# Altium schematic sheet 6-PadsControl+CodSwitch.SchDoc
size A4
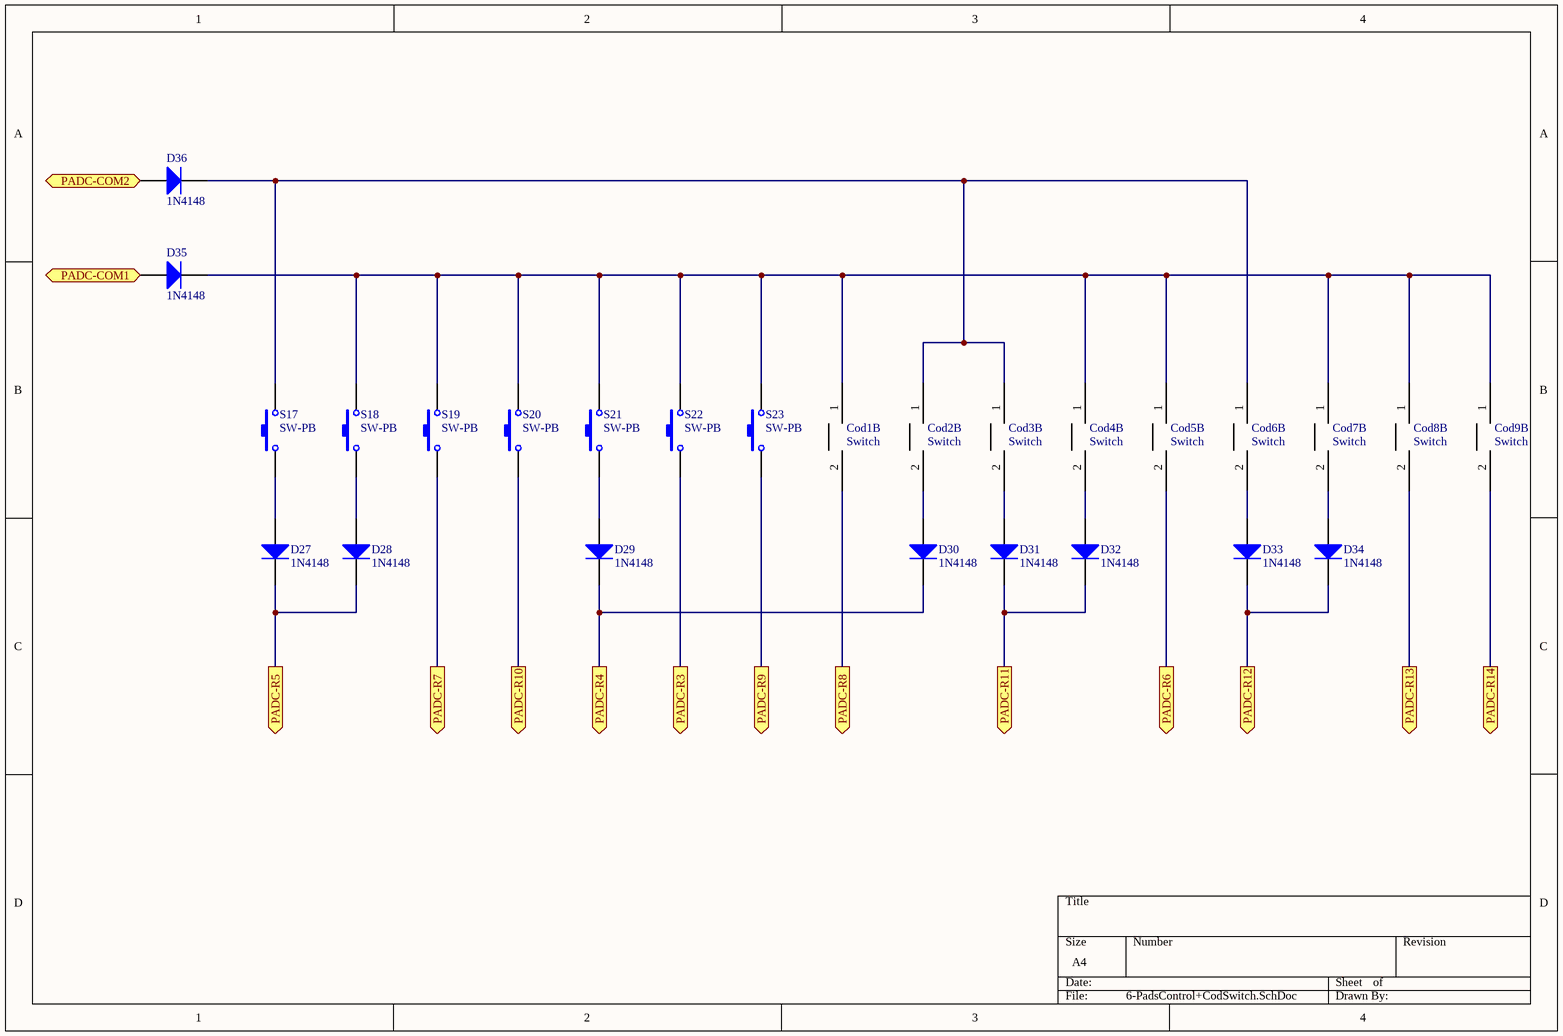
[diagram p0: 6-PadsControl+CodSwitch.SchDoc]

## Parts
Cod1  Switch  (part B of 2)
Cod2  Switch  (part B of 2)
Cod3  Switch  (part B of 2)
Cod4  Switch  (part B of 2)
Cod5  Switch  (part B of 2)
Cod6  Switch  (part B of 2)
Cod7  Switch  (part B of 2)
Cod8  Switch  (part B of 2)
Cod9  Switch  (part B of 2)
D27  1N4148  [SMC]
D28  1N4148  [SMC]
D29  1N4148  [SMC]
D30  1N4148  [SMC]
D31  1N4148  [SMC]
D32  1N4148  [SMC]
D33  1N4148  [SMC]
D34  1N4148  [SMC]
D35  1N4148  [SMC]
D36  1N4148  [SMC]
S17  SW-PB  [SPST-2]
S18  SW-PB  [SPST-2]
S19  SW-PB  [SPST-2]
S20  SW-PB  [SPST-2]
S21  SW-PB  [SPST-2]
S22  SW-PB  [SPST-2]
S23  SW-PB  [SPST-2]

## Ports
PADC-COM1 (in), PADC-COM2 (in), PADC-R3 (out), PADC-R4 (out), PADC-R5 (out), PADC-R6 (out), PADC-R7 (out), PADC-R8 (out), PADC-R9 (out), PADC-R10 (out), PADC-R11 (out), PADC-R12 (out), PADC-R13 (out), PADC-R14 (out)

## Nets
PADC-COM1: D35.1(A) ; port PADC-COM1
PADC-COM2: D36.1(A) ; port PADC-COM2
PADC-R3: S22.1 ; port PADC-R3
PADC-R4: D29.2(K) D30.2(K) ; port PADC-R4
PADC-R5: D27.2(K) D28.2(K) ; port PADC-R5
PADC-R6: Cod5.2 ; port PADC-R6
PADC-R7: S19.1 ; port PADC-R7
PADC-R8: Cod1.2 ; port PADC-R8
PADC-R9: S23.1 ; port PADC-R9
PADC-R10: S20.1 ; port PADC-R10
PADC-R11: D31.2(K) D32.2(K) ; port PADC-R11
PADC-R12: D33.2(K) D34.2(K) ; port PADC-R12
PADC-R13: Cod8.2 ; port PADC-R13
PADC-R14: Cod9.2 ; port PADC-R14
NetCod1_1: Cod1.1 Cod4.1 Cod5.1 Cod7.1 Cod8.1 Cod9.1 D35.2(K) S18.2 S19.2 S20.2 S21.2 S22.2 S23.2
NetCod2_1: Cod2.1 Cod3.1 Cod6.1 D36.2(K) S17.2
NetCod2_2: Cod2.2 D30.1(A)
NetCod3_2: Cod3.2 D31.1(A)
NetCod4_2: Cod4.2 D32.1(A)
NetCod6_2: Cod6.2 D33.1(A)
NetCod7_2: Cod7.2 D34.1(A)
NetD27_1: D27.1(A) S17.1
NetD28_1: D28.1(A) S18.1
NetD29_1: D29.1(A) S21.1

## Library data of the parts
Cod1-Cod9 = Cod
D27-D36 = Diode: Default Diode; Published: 8-Jun-2000; LatestRevisionDate: 17-Jul-2002; LatestRevisionNote: Re-released for DXP Platform.; PackageVersion: Sep-1996; PackageReference: SMC; Publisher: Altium Limited; PackageDescription: DO-214-AB/SMC; 2 C-Bend Leads; Body 7.9 x 5.9 mm, inc. leads (LxW); Code_JEDEC: DO-214-AB
S17-S23 = SW-PB: Switch; Published: 24-Mar-1999; LatestRevisionDate: 17-Jul-2002; LatestRevisionNote: Re-released for DXP Platform.; PackageReference: SPST-2; Publisher: Altium Limited; PackageDescription: Switch; 2 Leads